# EAGLE schematic interface (EAGLE 7.7.0)
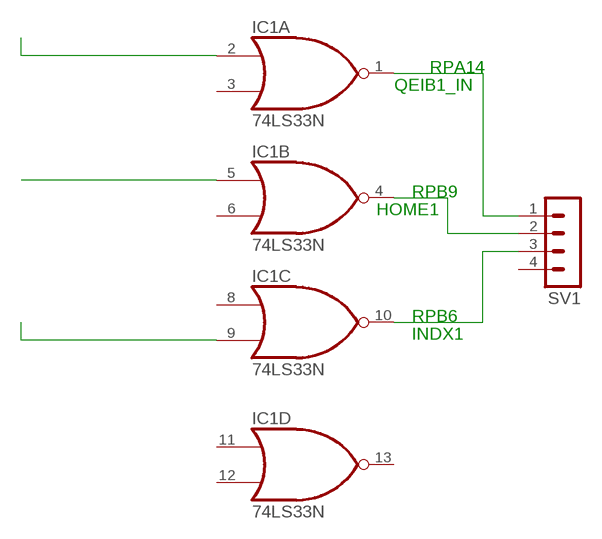
[diagram p0: schematic, sheet 1]

## Parts
IC1  74LS33N  [DIL14]
SV1  MA04-1  [MA04-1]

## Nets
N$1: IC1.1(A:O) SV1.1
N$2: IC1.10(C:O) SV1.3
N$3: IC1.4(B:O) SV1.2
N$4: IC1.2(A:I0)
N$5: IC1.5(B:I0)
N$6: IC1.9(C:I1)
Unconnected: IC1.3(A:I1) IC1.6(B:I1) IC1.8(C:I0) IC1.11(D:I0) IC1.12(D:I1) IC1.13(D:O) SV1.4

## Notes on the sheet
- RPA14
- QEIB1_IN
- RPB9
- HOME1
- RPB6
- INDX1

## Power pins joined to a net without a drawn wire
GND: IC1.7(P:GND)
VCC: IC1.14(P:VCC)

## Library data of the parts
IC1 = 74xx-us:74*33: Quad 2-input NOR buffer, open collector
SV1 = con-lstb:MA04-1: PIN HEADER; OC_FARNELL: unknown; OC_NEWARK: unknown